# Altium project Sensor_breakout.PrjPcb
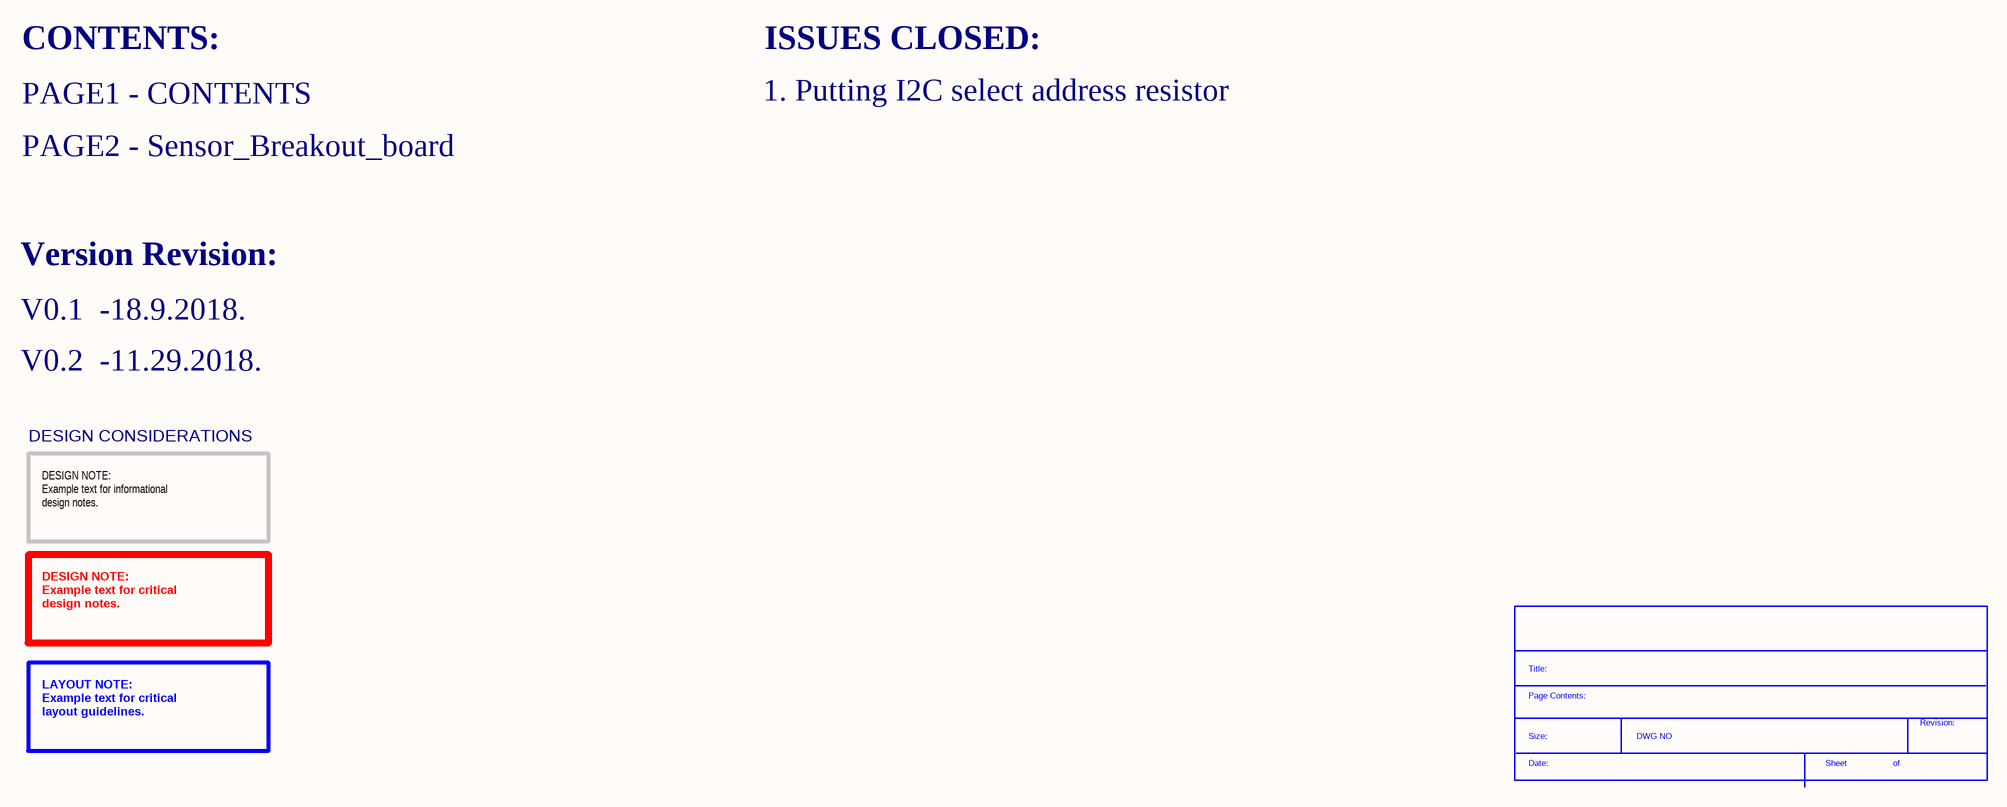
[diagram p0: PAGE1-CONTENTS.SchDoc]
Company: IRNAS; ProjectTitle: Sensor breakout board; Version: V0.2; Website: irnas.eu
1 sheet, 1 parts. Net scope: global (net labels, ports and power ports of the same name join across sheets).
Board file: Sensor_breakout.PcbDoc

## Sheet PAGE1-CONTENTS.SchDoc
size A3

### Parts
*?  SDTitleBlock  (value not drawn)  (graphical)

### Notes on the sheet
- CONTENTS:
- ISSUES CLOSED:
- PAGE1 - CONTENTS
- PAGE2 - Sensor_Breakout_board
- 1. Putting I2C select address resistor
- Version Revision:
- V0.1  -18.9.2018.
- V0.2  -11.29.2018.
- DESIGN CONSIDERATIONS
- DESIGN NOTE:
  Example text for informational
  design notes.
- DESIGN NOTE:
  Example text for critical
  design notes.
- LAYOUT NOTE:
  Example text for critical
  layout guidelines.
- (in symbol SDTitleBlock) Title:; Page Contents:; Revision:; Size:; DWG NO; Date:; Sheet; of